# EasyEDA Pro project my_supercap_1.eprj, schematic 上板

## Sheets
1 控制板_辅助电源与保护: Board Name: 上板; Create Date: 2026-09-18; Page Name: 控制板_辅助电源与保护; Project Name: my_supercap_1; Schematic Name: 上板; Update Date: 2026-09-19; Company: 嘉立创EDA; Page Size: A4; Version: V1.0
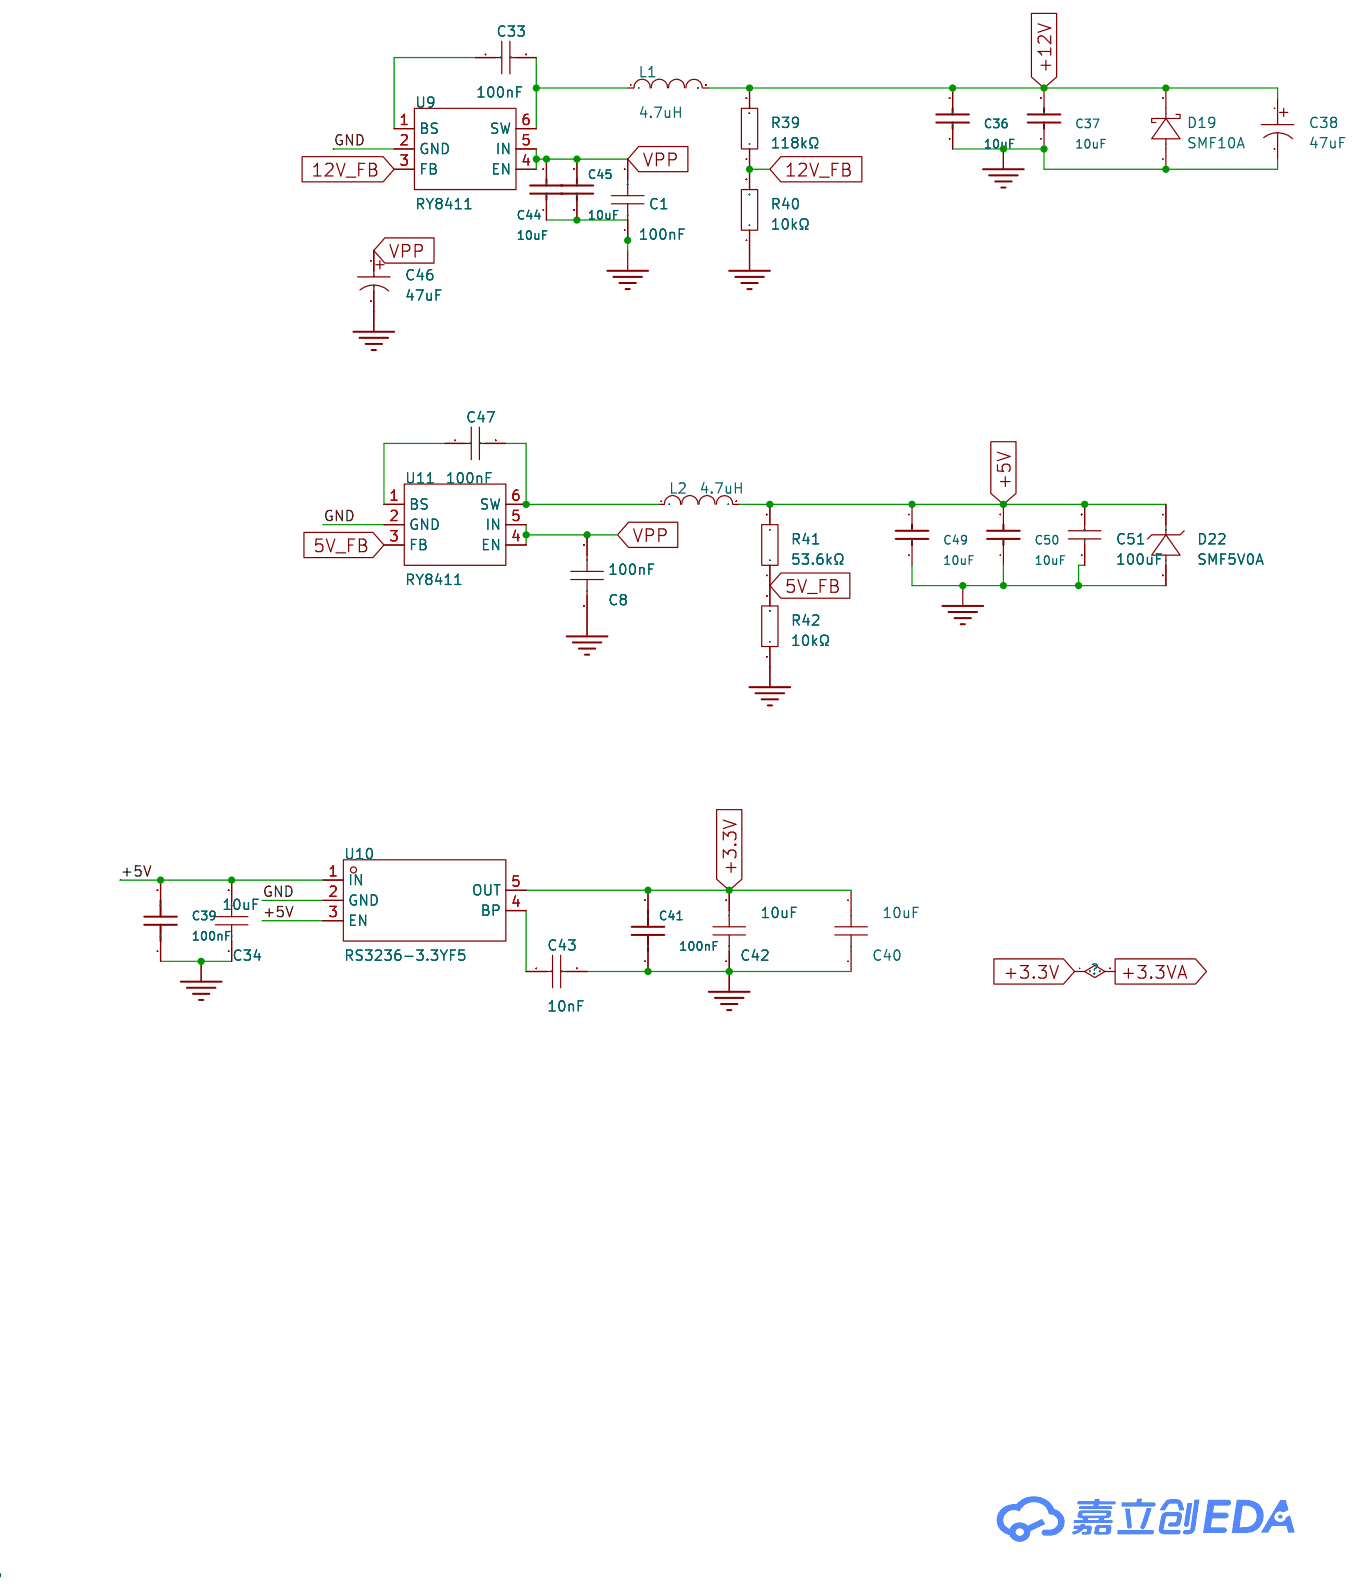
[diagram p4: 控制板_辅助电源与保护]
2 控制板_高侧隔离供电: Page Name: 控制板_高侧隔离供电
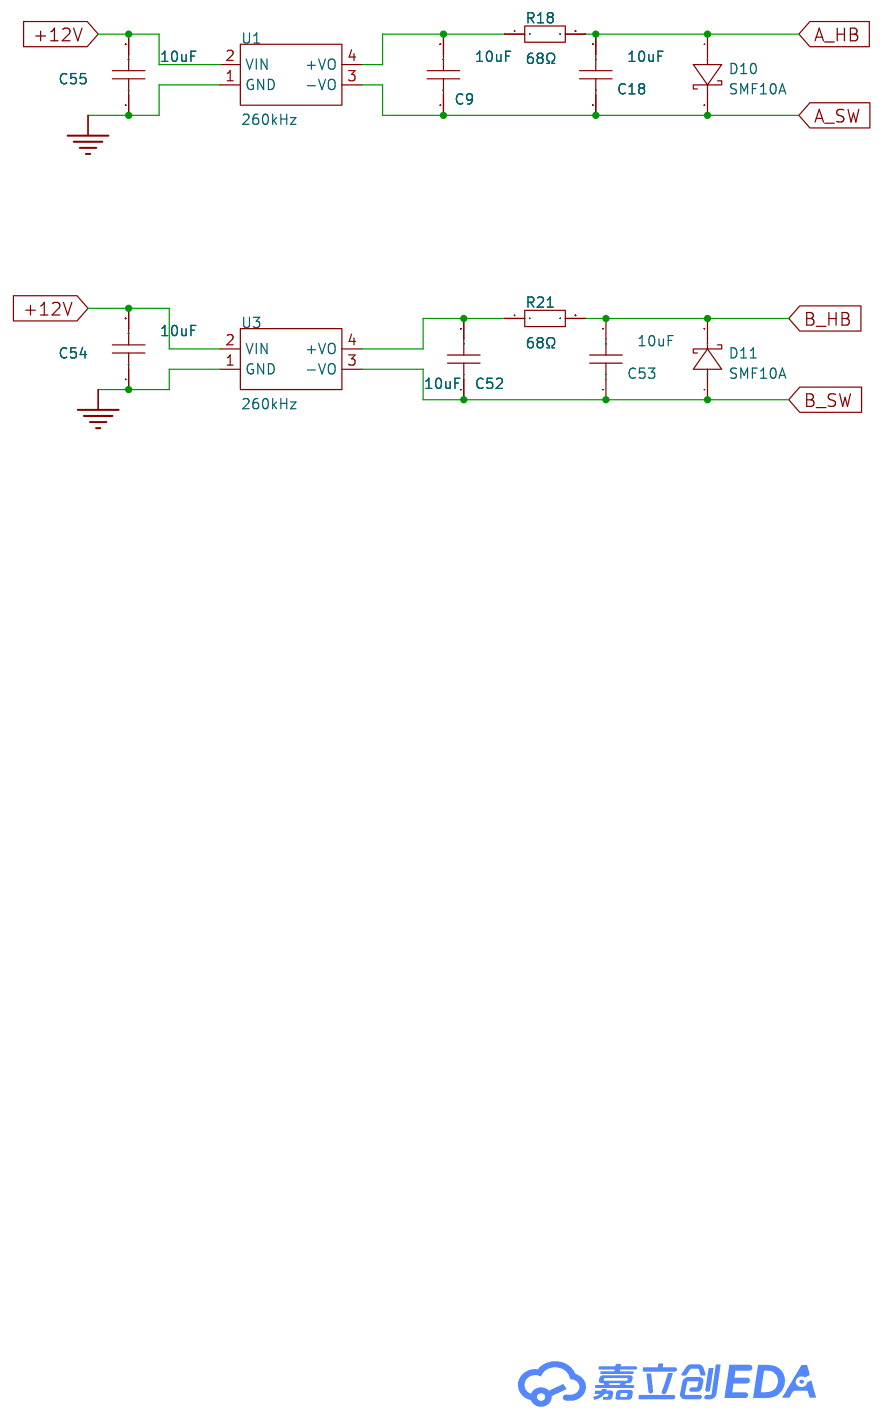
[diagram p5: 控制板_高侧隔离供电]
3 控制板_三路电流采样: Page Name: 控制板_三路电流采样; Update Date: 2026-09-20
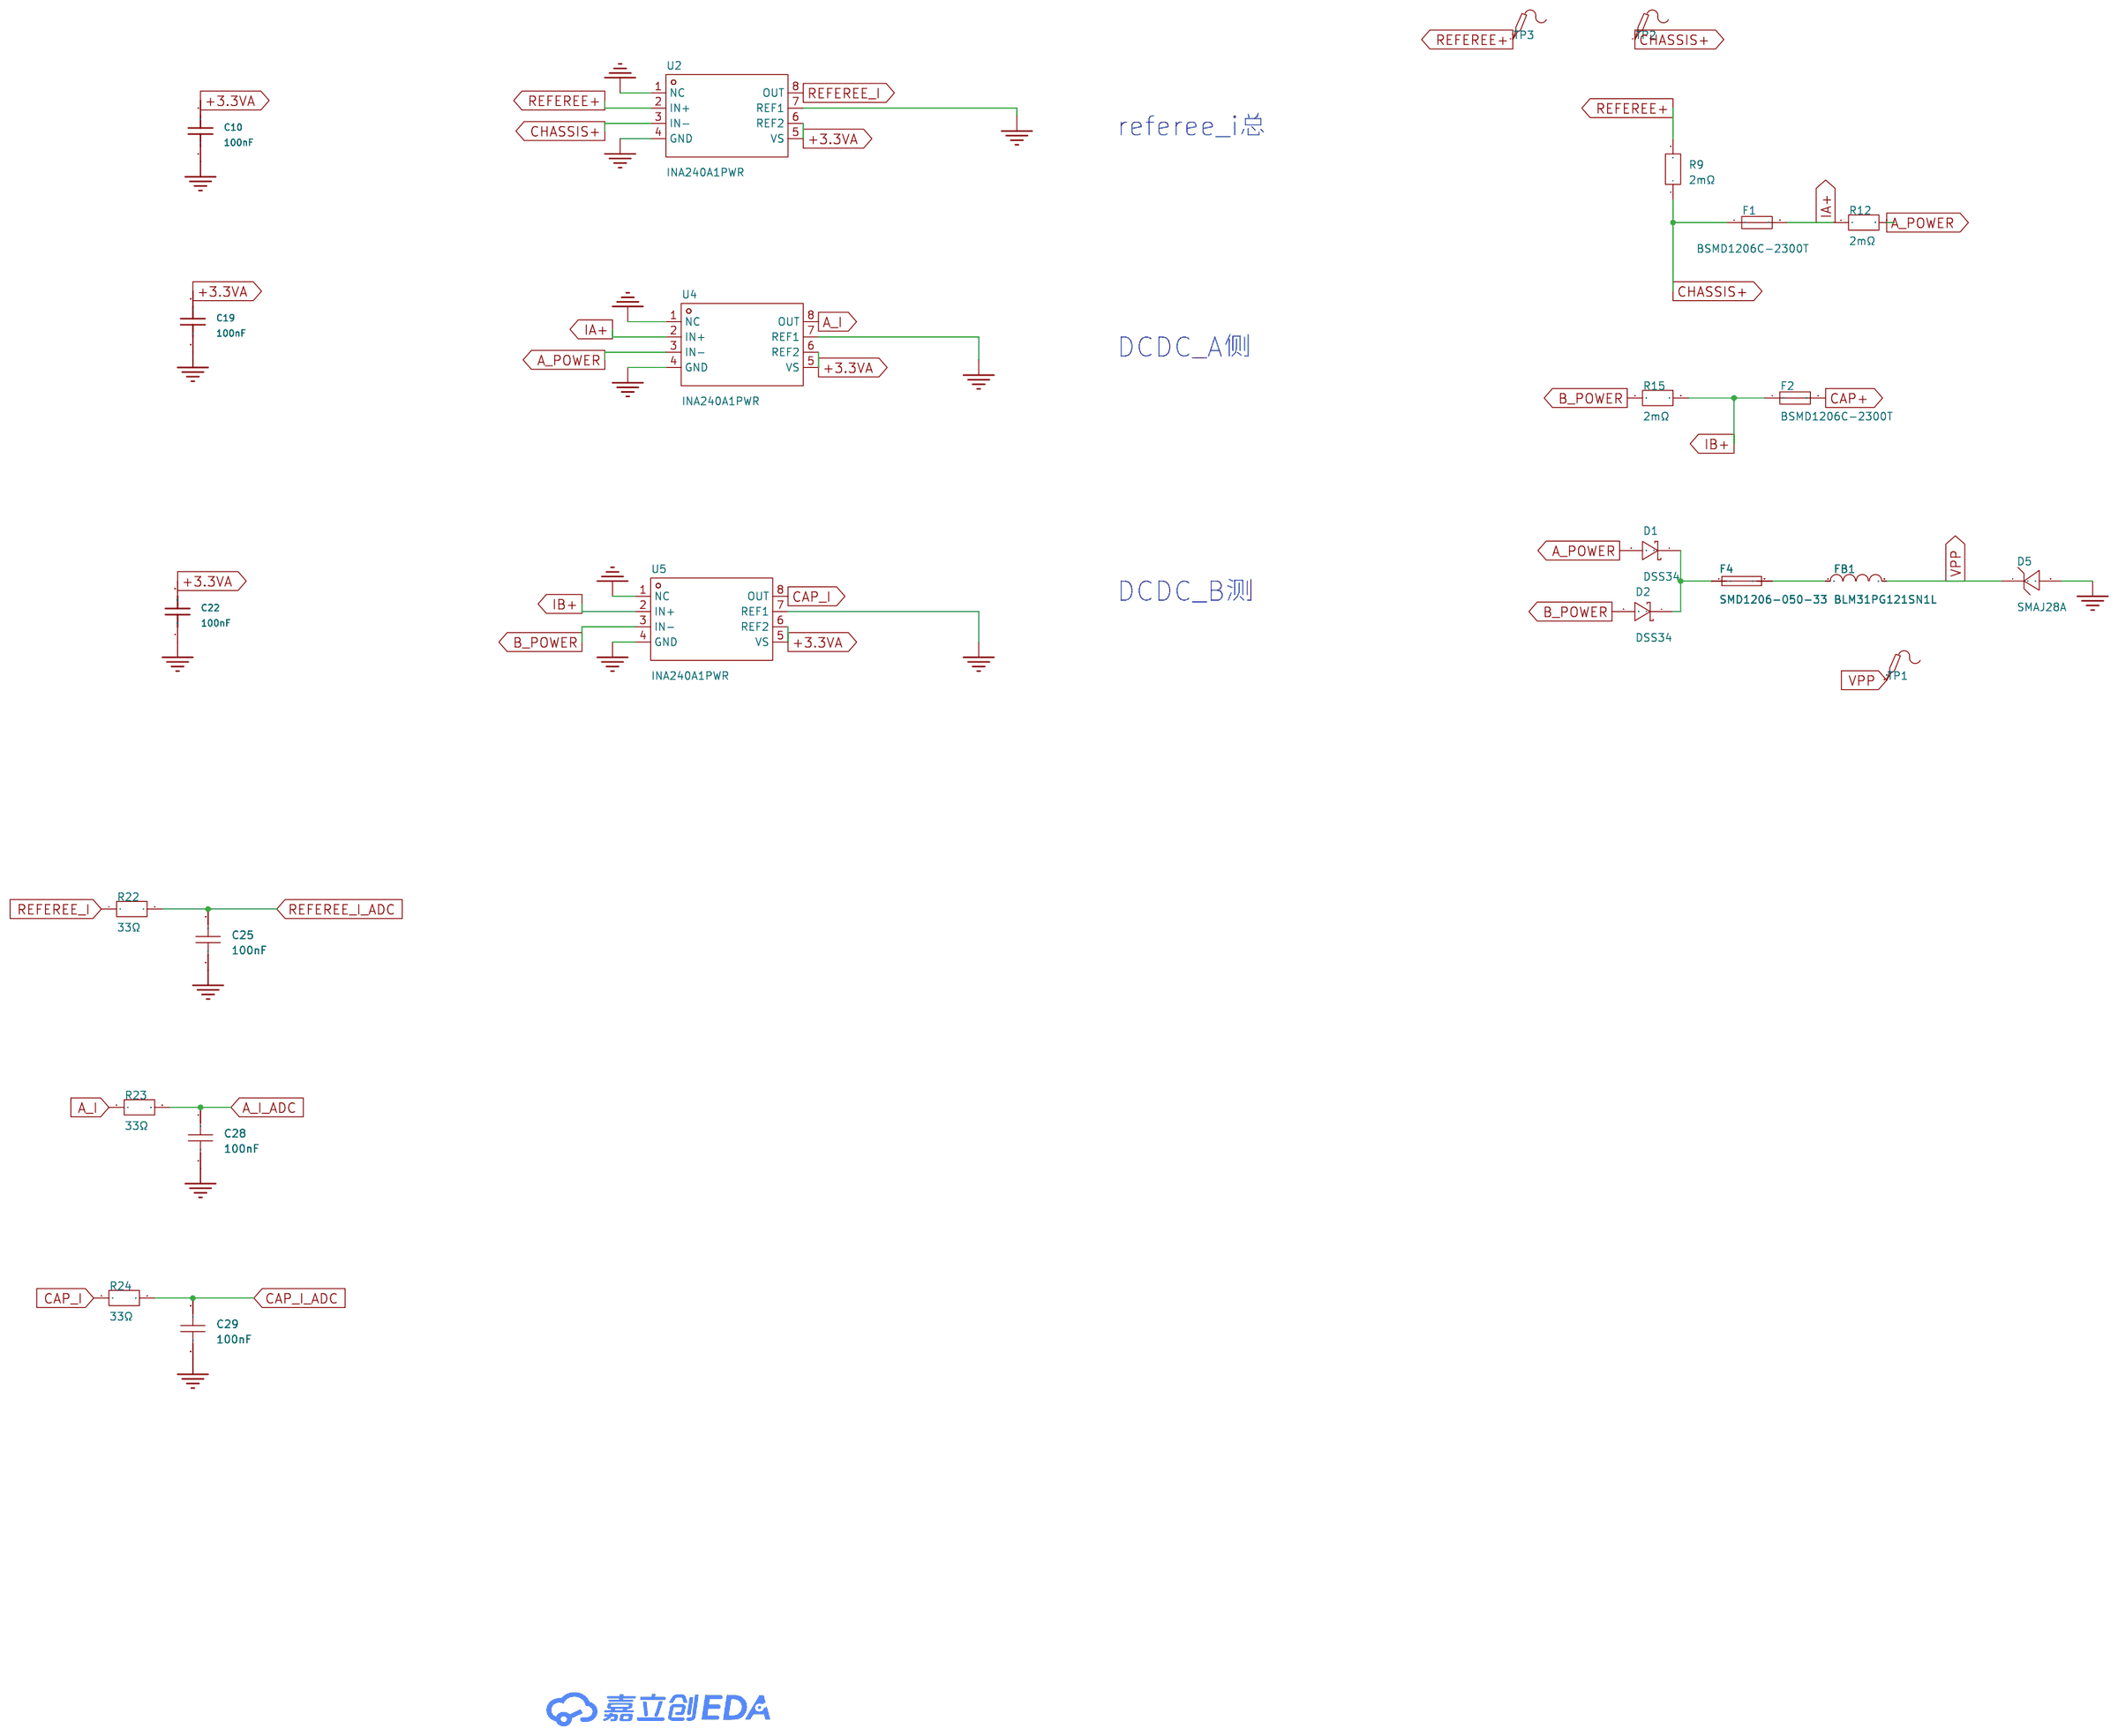
[diagram p6: 控制板_三路电流采样]
4 控制板_电压采样与模拟滤波: Page Name: 控制板_电压采样与模拟滤波
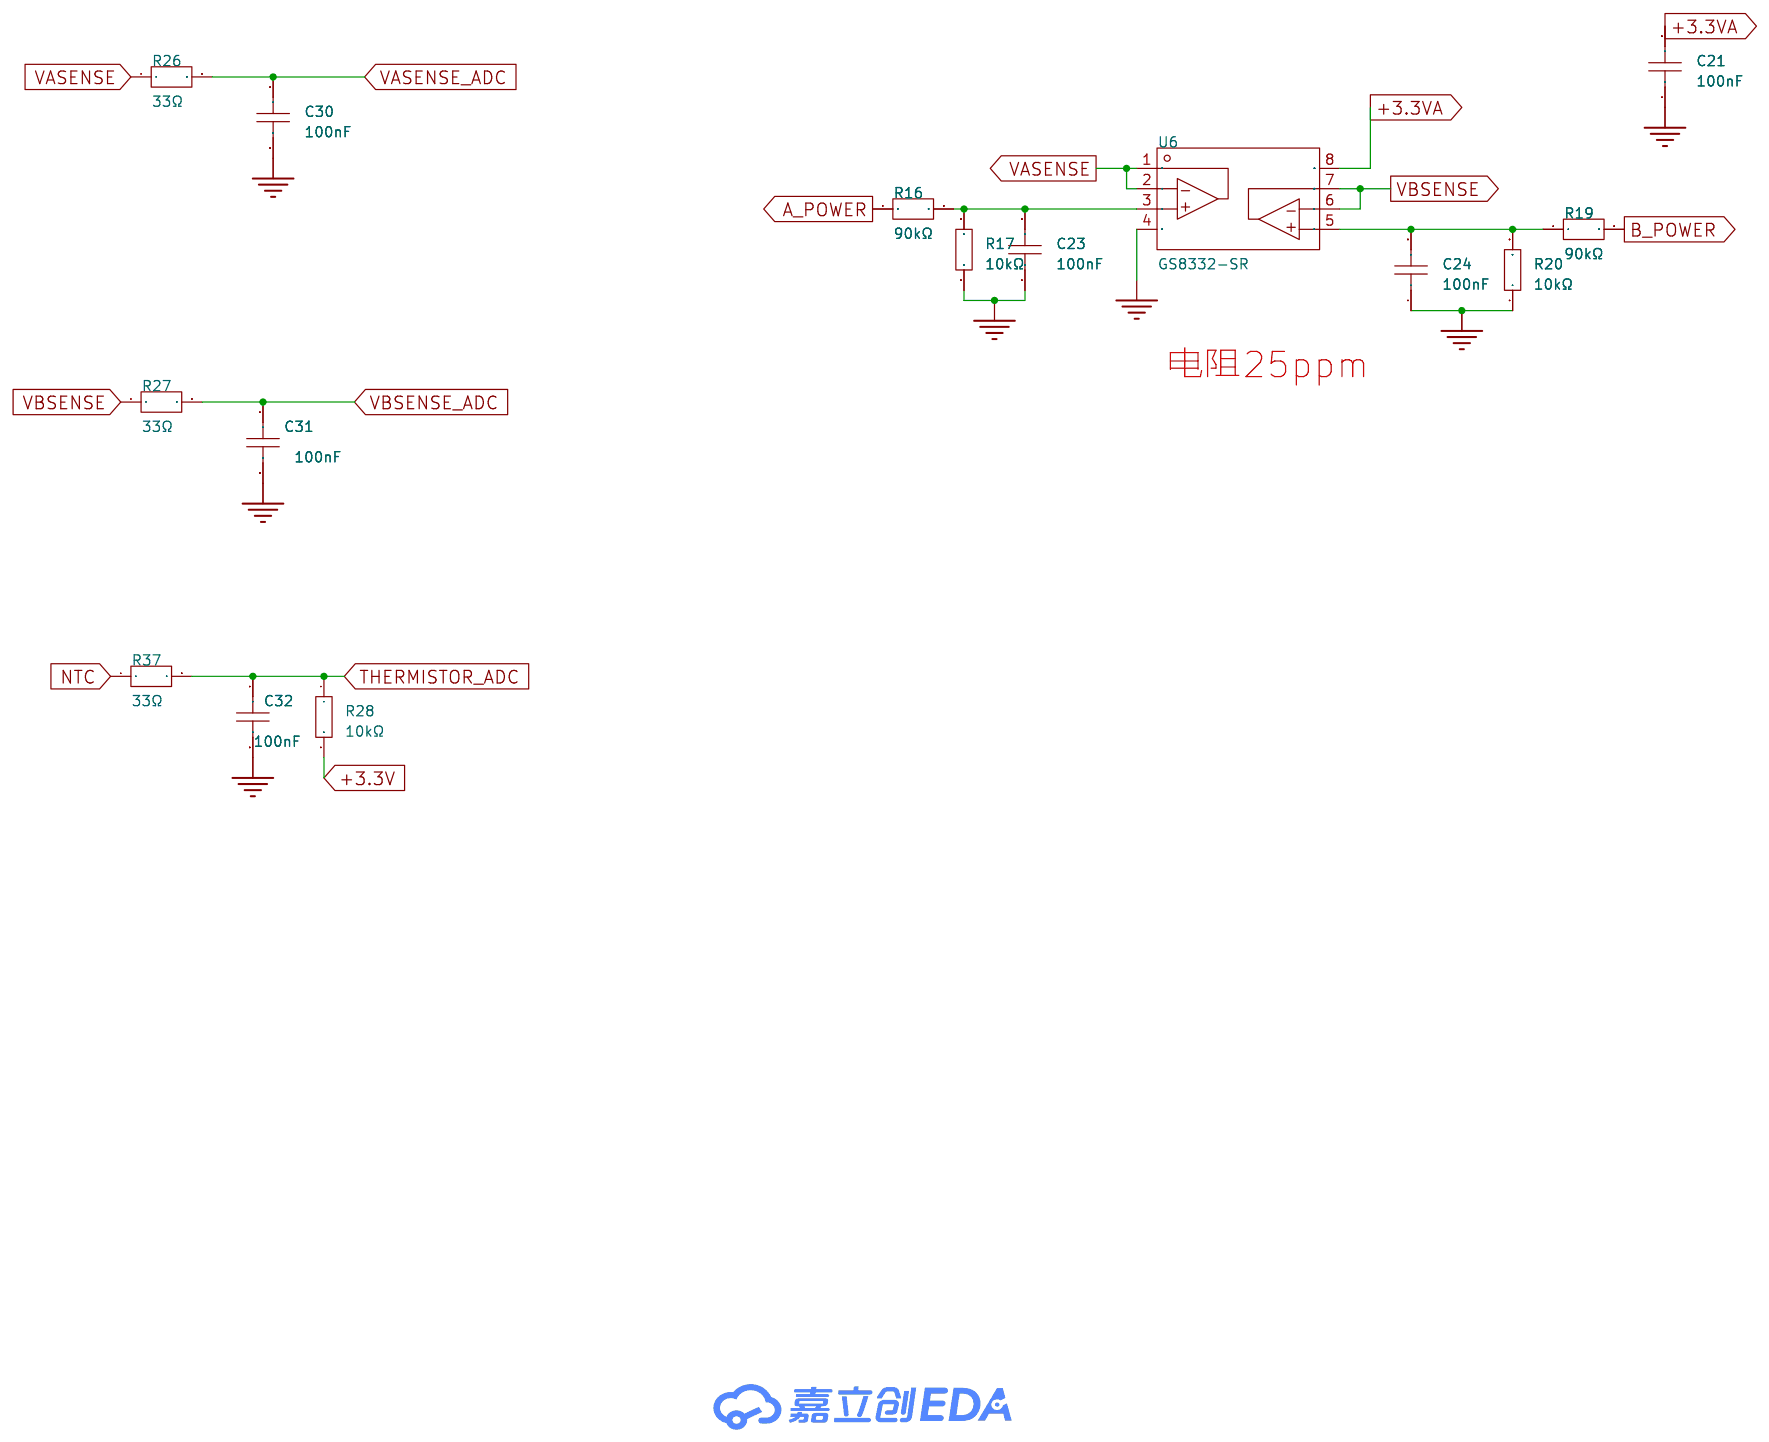
[diagram p7: 控制板_电压采样与模拟滤波]
5 控制板_STM32F334最小系统: Page Name: 控制板_STM32F334最小系统
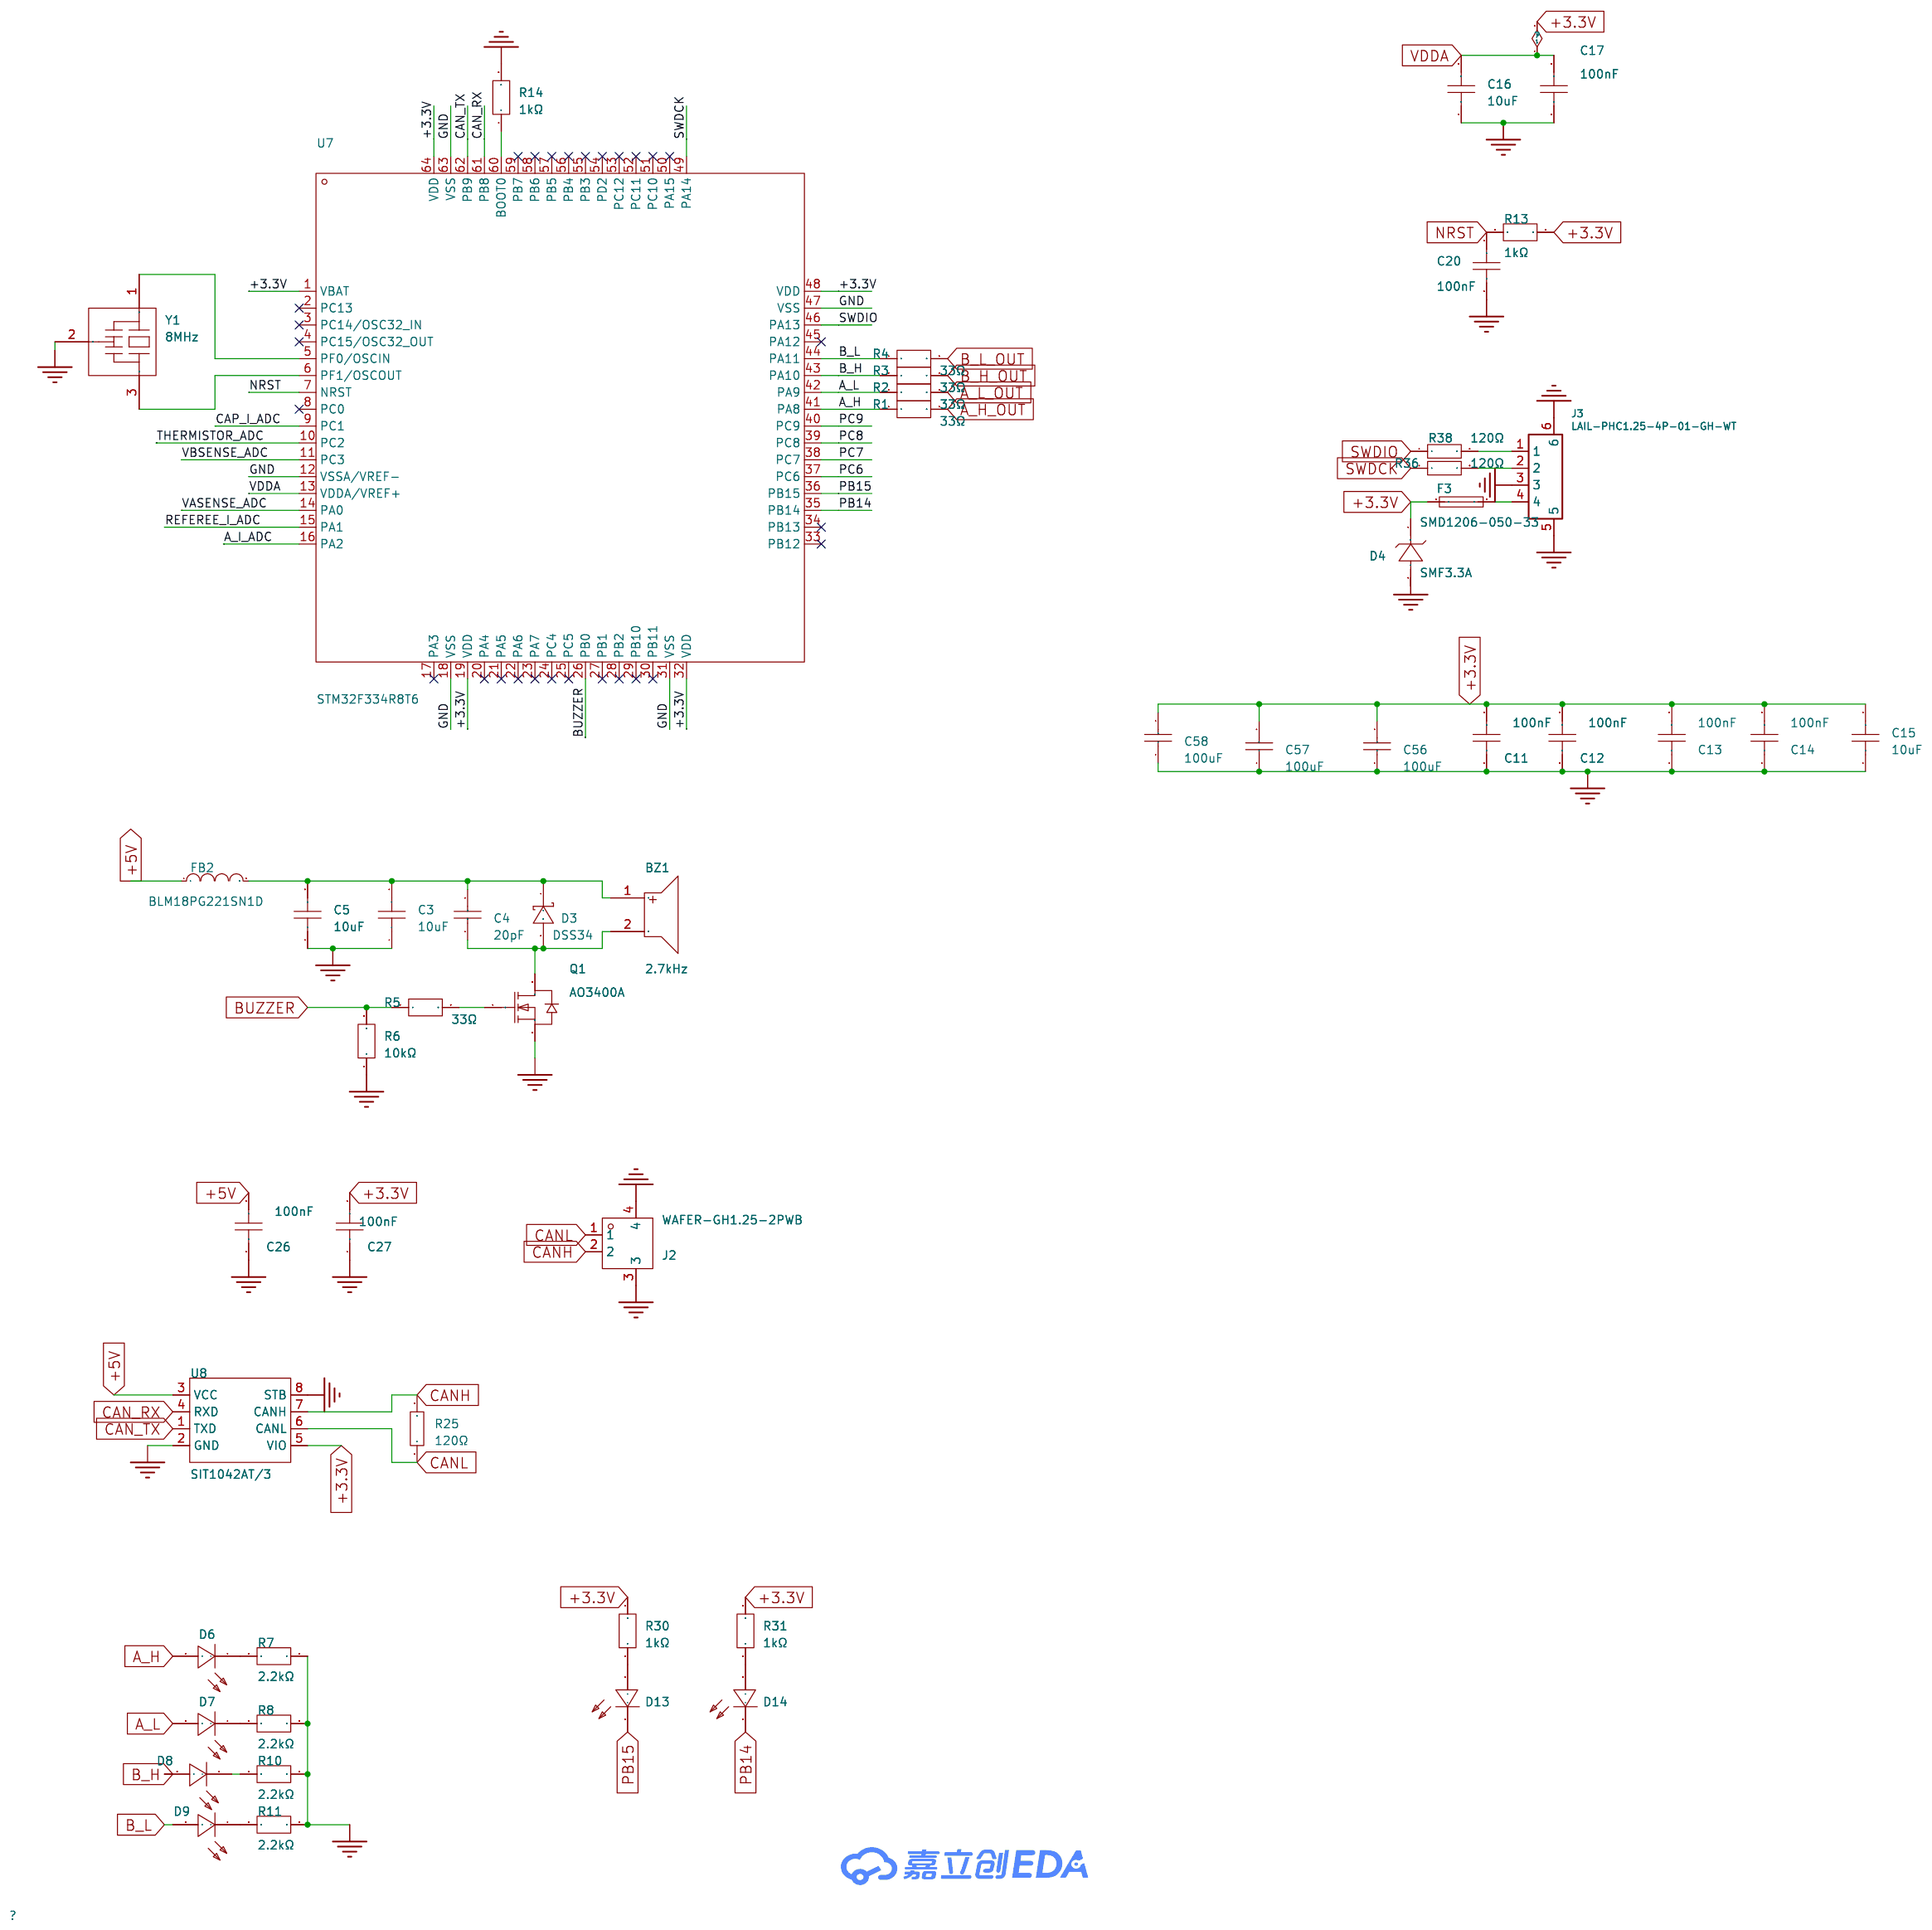
[diagram p8: 控制板_STM32F334最小系统]
6 上下板连接与调试测试点: Page Name: 上下板连接与调试测试点; Update Date: 2026-09-20
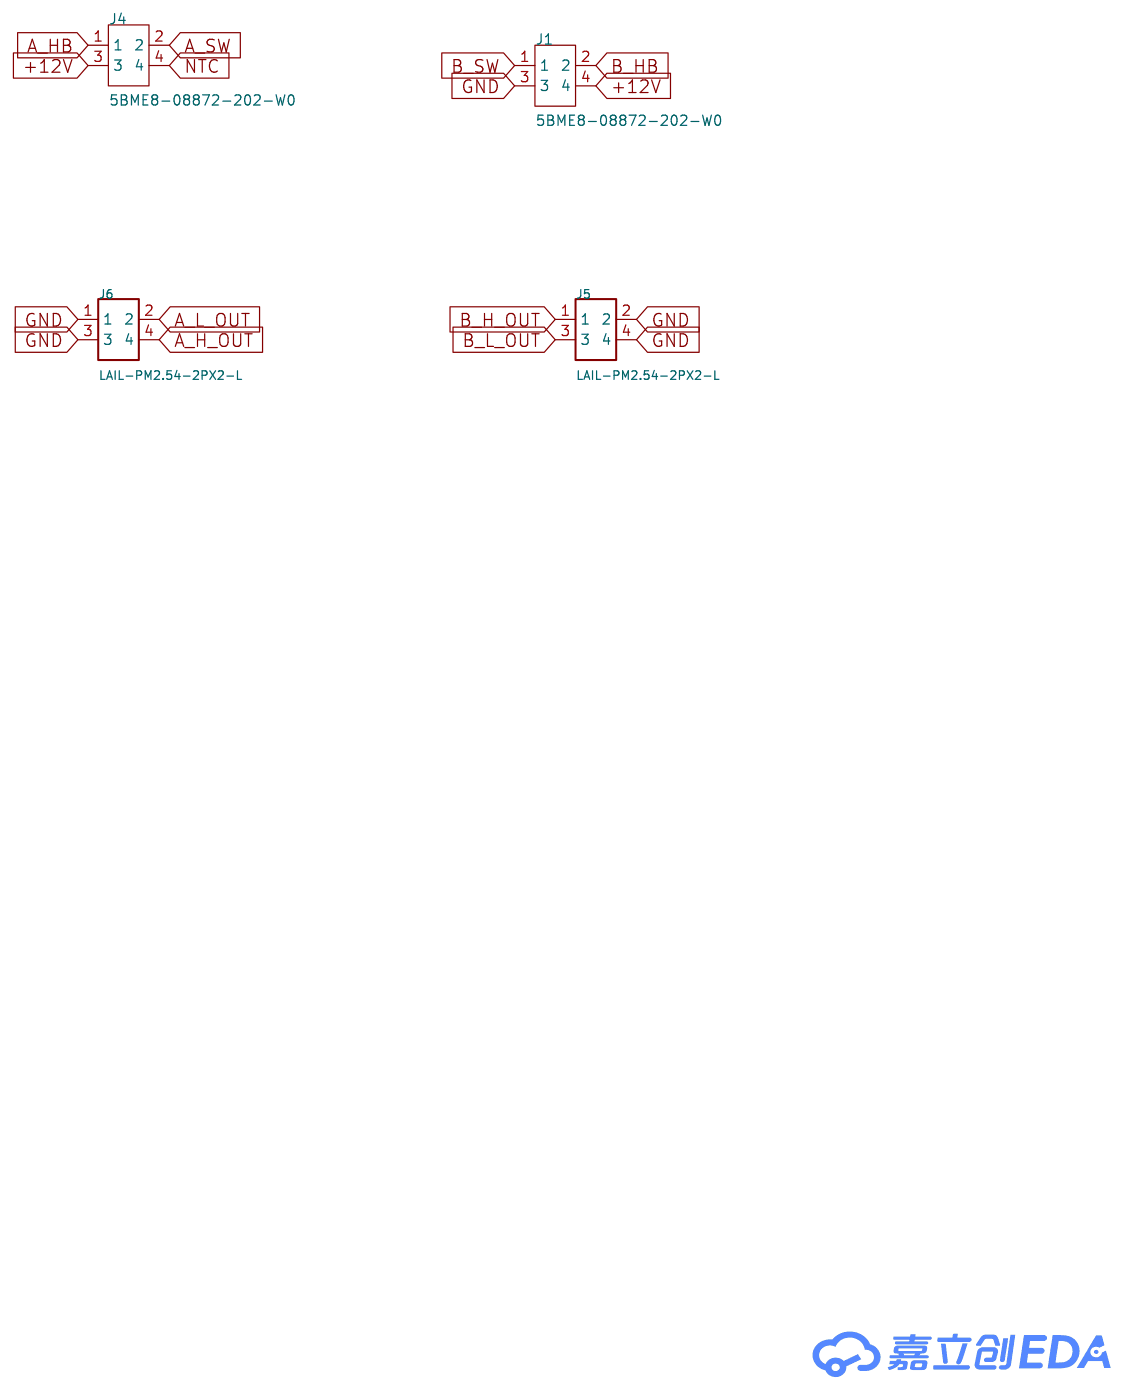
[diagram p9: 上下板连接与调试测试点]

## Parts
sheet 上下板连接与调试测试点
J1  5BME8-08872-202-W0  [CONN-SMD_5BME8-08872-202-W0]
J4  5BME8-08872-202-W0  [CONN-SMD_5BME8-08872-202-W0]
J5  LAIL-PM2.54-2PX2-L  [HDR-TH_4P-P2.54-V-F-R2-C2-S2.54-ESQ-102-33-L-D]
J6  LAIL-PM2.54-2PX2-L  [HDR-TH_4P-P2.54-V-F-R2-C2-S2.54-ESQ-102-33-L-D]
sheet 控制板_STM32F334最小系统
BZ1  2.7kHz  [BUZ-SMD_FUET-9032-XXV]
C3  10uF  [C0603]
C4  20pF  [C0603]
C5  10uF  [C0603]
C11  100nF  [C0603]
C12  100nF  [C0603]
C13  100nF  [C0603]
C14  100nF  [C0603]
C15  10uF  [C0603]
C16  10uF  [C0603]
C17  100nF  [C0603]
C20  100nF  [C0603]
C26  100nF  [C0603]
C27  100nF  [C0603]
C56  100uF  [C1206]
C57  100uF  [C1206]
C58  100uF  [C1206]
D3  DSS34  [SOD-123FL_L2.7-W1.8-LS3.8-RD]
D4  SMF3.3A  [SOD-123FL_L2.7-W1.8-LS3.7-RD]
D6  D-060306G1/SS2/G1  [LED0603-RD]
D7  D-060306G1/SS2/G1  [LED0603-RD]
D8  D-060306G1/SS2/G1  [LED0603-RD]
D9  D-060306G1/SS2/G1  [LED0603-RD]
D13  D-060306G1/SS2/G1  [LED0603-RD]
D14  D-060306G1/SS2/G1  [LED0603-RD]
F3  SMD1206-050-33  [F1206]
FB2  BLM18PG221SN1D  [L0603]
J2  WAFER-GH1.25-2PWB  [CONN-TH_2P-P1.25_XUNPU_WAFER-GH1.25-2PWB]
J3  LAIL-PHC1.25-4P-01-GH-WT  [CONN-SMD_4P-P1.25_HCTL_HC-GH-4PWTKK]
Q1  AO3400A  [SOT-23-3_L2.9-W1.3-P1.90-LS2.4-BR]
R1  33Ω  [R0603]
R2  33Ω  [R0603]
R3  33Ω  [R0603]
R4  33Ω  [R0603]
R5  33Ω  [R0603]
R6  10kΩ  [R0603]
R7  2.2kΩ  [R0603]
R8  2.2kΩ  [R0603]
R10  2.2kΩ  [R0603]
R11  2.2kΩ  [R0603]
R13  1kΩ  [R0603]
R14  1kΩ  [R0603]
R25  120Ω  [R0603]
R30  1kΩ  [R0603]
R31  1kΩ  [R0603]
R36  120Ω  [R0603]
R38  120Ω  [R0603]
U7  STM32F334R8T6  [LQFP-64_L10.0-W10.0-P0.50-LS12.0-BL]
U8  SIT1042AT/3  [SOIC-8_L4.9-W3.9-P1.27-LS6.0-BL]
Y1  8MHz  [OSC-SMD_3P-L3.2-W1.3-P1.2-L]
sheet 控制板_三路电流采样
C10  100nF  [C0603]
C19  100nF  [C0603]
C22  100nF  [C0603]
C25  100nF  [C0603]
C28  100nF  [C0603]
C29  100nF  [C0603]
D1  DSS34  [SOD-123FL_L2.7-W1.8-LS3.8-RD]
D2  DSS34  [SOD-123FL_L2.7-W1.8-LS3.8-RD]
D5  SMAJ28A  [SMA_L4.4-W2.8-LS5.4-RD]
F1  BSMD1206C-2300T  [F1206]
F2  BSMD1206C-2300T  [F1206]
F4  SMD1206-050-33  [F1206]
FB1  BLM31PG121SN1L  [L1206]
R9  2mΩ  [RES-SMD_L6.4-W3.2-1]
R12  2mΩ  [RES-SMD_L6.4-W3.2-1]
R15  2mΩ  [RES-SMD_L6.4-W3.2-1]
R22  33Ω  [R0603]
R23  33Ω  [R0603]
R24  33Ω  [R0603]
TP1  -  [Test-Point-0.5mm]
TP2  -  [Test-Point-0.5mm]
TP3  -  [Test-Point-0.5mm]
U2  INA240A1PWR  [TSSOP-8_L4.4-W3.0-P0.65-LS6.4-BL]
U4  INA240A1PWR  [TSSOP-8_L4.4-W3.0-P0.65-LS6.4-BL]
U5  INA240A1PWR  [TSSOP-8_L4.4-W3.0-P0.65-LS6.4-BL]
sheet 控制板_电压采样与模拟滤波
C21  100nF  [C0603]
C23  100nF  [C0603]
C24  100nF  [C0603]
C30  100nF  [C0603]
C31  100nF  [C0603]
C32  100nF  [C0603]
R16  90kΩ  [R0805]
R17  10kΩ  [R0603]
R19  90kΩ  [R0805]
R20  10kΩ  [R0603]
R26  33Ω  [R0603]
R27  33Ω  [R0603]
R28  10kΩ  [R0603]
R37  33Ω  [R0603]
U6  GS8332-SR  [SOP-8_L4.9-W3.9-P1.27-LS6.0-BL]
sheet 控制板_辅助电源与保护
C1  100nF  [C0603]
C8  100nF  [C0603]
C33  100nF  [C0603]
C34  10uF  [C0603]
C36  10uF  [C1206]
C37  10uF  [C1206]
C38  47uF  [CAP-SMD_BD6.3-L6.6-W6.6-LS7.6-FD]
C39  100nF  [C0603]
C40  10uF  [C0603]
C41  100nF  [C0603]
C42  10uF  [C0603]
C43  10nF  [C0603]
C44  10uF  [C1206]
C45  10uF  [C1206]
C46  47uF  [CAP-SMD_BD6.3-L6.6-W6.6-LS7.6-FD]
C47  100nF  [C0603]
C49  10uF  [C1206]
C50  10uF  [C1206]
C51  100uF  [C1206]
D19  SMF10A  [SOD-123FL_L3.0-W1.8-LS3.7-R-RD]
D22  SMF5V0A  [SOD-123_L2.7-W1.8-LS3.7-RD]
L1  4.7uH  [IND-SMD_L4.0-W4.0_SRN4018TA]
L2  4.7uH  [IND-SMD_L2.5-W2.0]
R39  118kΩ  [R0603]
R40  10kΩ  [R0603]
R41  53.6kΩ  [R0603]
R42  10kΩ  [R0603]
U9  RY8411  [SOT-23-6_L2.9-W1.6-P0.95-LS2.8-TL]
U10  RS3236-3.3YF5  [SOT-23-5_L3.0-W1.7-P0.95-LS2.8-BR]
U11  RY8411  [SOT-23-6_L2.9-W1.6-P0.95-LS2.8-TL]
sheet 控制板_高侧隔离供电
C9  10uF  [C1206]
C18  10uF  [C1206]
C52  10uF  [C1206]
C53  10uF  [C1206]
C54  10uF  [C1206]
C55  10uF  [C1206]
D10  SMF10A  [SOD-123FL_L3.0-W1.8-LS3.7-R-RD]
D11  SMF10A  [SOD-123FL_L3.0-W1.8-LS3.7-R-RD]
R18  68Ω  [R0603]
R21  68Ω  [R0603]
U1  260kHz  [PWRM-TH_4P-L11.5-W6.1-P2.54_1]
U3  260kHz  [PWRM-TH_4P-L11.5-W6.1-P2.54_1]

## Library data of the parts
J1 J4 = 5BME8-08872-202-W0: LCSC Part Name: 2x2P 间距:2.54mm 立贴; Supplier Part: C39832992; Manufacturer: SAMZO(三佐); Supplier Footprint: SMD,P=2.54mm; Datasheet: https://item.szlcsc.com/datasheet/5BME8-08872-202-W0/41562137.html; Supplier: LCSC; Holes Structure: 2x2P; Pitch: 2.54mm; Row Spacing: 2.54mm; Circular Hole / Square Hole: 方孔; Mounting Type: 立贴; Number of Rows: 双排; Number of Positions: 4P; Current Rating: 3A; Holes Direction: 顶部; Insulation Height: 8.5mm; Contact Material: 黄铜; Contact Plating: 金; Operating Temperature: -40℃~+105℃
J5 J6 = LAIL-PM2.54-2PX2-L: LCSC Part Name: 2x2P 间距:2.54mm 直插; Supplier Part: C54973841; Manufacturer: 莱联; Supplier Footprint: 插件,P=2.54mm; JLCPCB Part Class: 扩展库; Datasheet: https://item.szlcsc.com/datasheet/LAIL-PM2.54-2PX2-L/58554919.html; Supplier: LCSC; Holes Structure: 2x2P; Pitch: 2.54mm; Row Spacing: 2.54mm; Circular Hole / Square Hole: 方孔; Mounting Type: 直插; Number of Rows: 双排; Number of Positions: 4P; Current Rating: 3A; Voltage Rating (Max): 250V; Holes Direction: 顶部; Insulation Height: 8.5mm; Contact Material: 黄铜; Contact Plating: 金; Operating Temperature: -25℃~+80℃; PIN Length: 3mm
BZ1 = FUET-9032-05: LCSC Part Name: 蜂鸣器; Supplier Part: C2690510; Manufacturer: FUET(福声科技); Supplier Footprint: SMD,D=9mm; JLCPCB Part Class: 扩展库; Datasheet: https://item.szlcsc.com/datasheet/FUET-9032-05/2799828.html; Supplier: LCSC; Technology: 电磁式; Voltage - Supply: 4V~7V; Current Consumption: 100mA; Sound Pressure Level(SPL): 85dB; Diameter(φD): 9mm; Length: 10.5mm; Width: 9mm; Height: 3.2mm; Operating Temperature: -30℃~+70℃; Mounting Type: 贴片
C3 C5 C15 C16 = CGA0603X5R106K100JT: LCSC Part Name: 10uF ±10% 10V; Supplier Part: C6119842; Manufacturer: HRE(芯声); Supplier Footprint: 0603; JLCPCB Part Class: 扩展库; Datasheet: https://item.szlcsc.com/datasheet/CGA0603X5R106K100JT/7062548.html; Supplier: LCSC; Tolerance: ±10%; Voltage Rating: 10V; Temperature Coefficient: X5R
C4 = CC0603JRNPO9BN200: LCSC Part Name: 20pF ±5% 50V; Supplier Part: C105621; Manufacturer: YAGEO(国巨); Supplier Footprint: 0603; JLCPCB Part Class: 扩展库; Datasheet: https://atta.szlcsc.com/upload/public/pdf/source/20170505/1493957838062.pdf; Supplier: LCSC; Tolerance: ±5%; Voltage Rated: 50V; Temperature Coefficient: NP0
C1 C8 C11-C14 C17 C20 C21 C23-C32 = 0603B104M500NT: LCSC Part Name: 100nF ±20% 50V; Supplier Part: C286510; Manufacturer: FH(风华); Supplier Footprint: 0603; JLCPCB Part Class: 扩展库; Datasheet: https://item.szlcsc.com/datasheet/0603B104M500NT/271775.html; Supplier: LCSC; Tolerance: ±20%; Voltage Rating: 50V; Temperature Coefficient: X7R
C51 C56-C58 = CL31A107MQHNNNE: LCSC Part Name: 100uF ±20% 6.3V; Supplier Part: C15008; Manufacturer: SAMSUNG(三星); Supplier Footprint: 1206; JLCPCB Part Class: 基础库; Datasheet: https://item.szlcsc.com/datasheet/CL31A107MQHNNNE/15681.html; Supplier: LCSC; Tolerance: ±20%; Voltage Rating: 6.3V; Temperature Coefficient: X5R
D1-D3 = DSS34_C511866: LCSC Part Name: 电压:40V 电流:3A; Supplier Part: C511866; Manufacturer: BORN(伯恩半导体); Supplier Footprint: SOD-123FL; JLCPCB Part Class: 扩展库; Datasheet: https://item.szlcsc.com/datasheet/DSS34/526331.html; Supplier: LCSC; Voltage - Forward(Vf@If): 550mV@3A; Voltage - DC Reverse(Vr): 40V; Current - Rectified: 3A; Reverse Leakage Current (Ir): 500uA@40V; Operating Junction Temperature Range: -50℃~+125℃
D4 = SMF3.3A_C51891832: LCSC Part Name: 单向 3.3V 22.7A@10/1000us; Supplier Part: C51891832; Manufacturer: R+O(宏嘉诚); Supplier Footprint: SOD-123FL; JLCPCB Part Class: 扩展库; Datasheet: https://item.szlcsc.com/datasheet/SMF3.3A/54568752.html; Supplier: LCSC; Polarity: 单向; Reverse Stand-Off Voltage (Vrwm): 3.3V; Clamping Voltage: 8.8V; Peak Pulse Current (Ipp): 22.7A@10/1000us; Peak Pulse Power Dissipation (Ppp): 200W@10/1000us; Voltage - Breakdown: 6.5V; Reverse Leakage Current (Ir): 500uA; Number of Channels: 单路; Operating Temperature: -55℃~+150℃; level of protection: IEC 61000-4-2; Type: TVS
D6-D9 D13 D14 = D-060306G1/SS2/G1: LCSC Part Name: 翠绿; Supplier Part: C118334; Manufacturer: ARKLED(方舟); Supplier Footprint: 0603; Datasheet: https://item.szlcsc.com/datasheet/D-060306G1%252FSS2%252FG1/119599.html; Supplier: LCSC; Illumination Color: 翠绿色; Voltage - Forward(Vf): 2.8V; Power(Watts): 70mW; Forward Current: 5mA; Wavelength - Dominant: 526nm~532nm; Diode Configuration: 独立二极管; Lens Color: 无色透明透镜; Luminous Intensity: 500mcd; Viewing Angle: 120°; Mounting Style: 正贴; Operating Temperature: -30℃~+80℃
F3 F4 = SMD1206-050-33: LCSC Part Name: 33V 500mA; Supplier Part: C46641017; Manufacturer: R+O(宏嘉诚); Supplier Footprint: 1206; JLCPCB Part Class: 扩展库; Datasheet: https://item.szlcsc.com/datasheet/SMD1206-050-33/48798723.html; Supplier: LCSC; Voltage - Max: 33V; Current - Max: 40A; Hold Current: 500mA; Trip Current: 1A; Power Dissipation: 600mW; Resistance - Initial (Ri) (Min): 150mΩ; Resistance - Post Trip (R1) (Max): 750mΩ; Time to Trip(Max): 100ms; Length: 3.6mm; Width: 1.9mm
FB2 = BLM18PG221SN1D: LCSC Part Name: 单路 0603磁珠 阻抗220Ω@100MHz; Supplier Part: C80165; Manufacturer: muRata(村田); Supplier Footprint: 0603; Datasheet: https://item.szlcsc.com/datasheet/BLM18PG221SN1D/81310.html; Supplier: LCSC; Impedance @ Frequency: 220Ω@100MHz; Tolerance: ±25%; DC Resistance(DCR): 100mΩ; Current Rating: 1.4A; Number of Circuits: 1; Operating Temperature: -55℃~+125℃
J2 = WAFER-GH1.25-2PWB: LCSC Part Name: 1x2P 间距:1.25mm 卧贴 系列:GH; Supplier Part: C3029377; Manufacturer: XUNPU(讯普); Supplier Footprint: SMD,P=1.25mm,卧贴; JLCPCB Part Class: 扩展库; Datasheet: https://item.szlcsc.com/datasheet/WAFER-GH1.25-2PWB/3561389.html; Supplier: LCSC; Pins Structure: 1x2P; Pitch: 1.25mm; Mounting Type: 卧贴; Reference Series: GH; Number of Pins: 2P; Number of Rows: 1; Number of PINs Per Row: 2; Current Rating: 1A; Contact Material: 黄铜; Contact Plating: 锡; Operating Temperature: -25℃~+85℃; Voltage Rating: 125V; Plastic Material: LCP; Supplementary Features: 辅助焊脚; Color: 米色; Z-Height of the Board: 4.35mm; X-Length of Bottom Edge on Board (Spacing Line): 5.75mm; Y-Width of Bottom Edge on Board: 5mm
J3 = LAIL-PHC1.25-4P-01-GH-WT: LCSC Part Name: 1x4P 间距:1.25mm 卧贴 系列:GH; Supplier Part: C54905900; Manufacturer: LAILAN(莱联); Supplier Footprint: SMD,P=1.25mm,卧贴; JLCPCB Part Class: 扩展库; Datasheet: https://item.szlcsc.com/datasheet/LAIL-PHC1.25-4P-01-GH-WT/58431077.html; Supplier: LCSC; Pins Structure: 1x4P; Pitch: 1.25mm; Mounting Type: 卧贴; Reference Series: GH; Number of Pins: 4P; Number of Rows: 1; Number of PINs Per Row: 4; Current Rating: 1A; Contact Material: 磷青铜; Contact Plating: 锡; Operating Temperature: -25℃~+85℃; Voltage Rating: 50V; Plastic Material: LCP; Flame Retardant Rating: UL94V-0; Supplementary Features: 辅助焊脚; Color: 米黄色; Z-Height of the Board: 4.4mm; X-Length of Bottom Edge on Board (Spacing Line): 8.25mm; Y-Width of Bottom Edge on Board: 4.9mm
Q1 = AO3400A_C20917: LCSC Part Name: N沟道 耐压:30V; Supplier Part: C20917; Manufacturer: AOS; Supplier Footprint: SOT-23; JLCPCB Part Class: 基础库; Datasheet: https://item.szlcsc.com/datasheet/AO3400A/21629.html; Supplier: LCSC; Number: 1个N沟道; Drain to Source Voltage: 30V; Current - Continuous Drain(Id): 5.7A; RDS(on): 48mΩ@2.5V; Pd - Power Dissipation: 1.4W; Gate Threshold Voltage (Vgs(th)): 1.45V; Gate Charge(Qg): 7nC@10V; Input Capacitance(Ciss): 630pF; Reverse Transfer Capacitance (Crss@Vds): 50pF; Operating Temperature: -55℃~+150℃; Type: N沟道; Output Capacitance(Coss): 75pF; Vgs: ±12V
R1-R5 R22-R24 R26 R27 R37 = FRC0603F33R0TS: LCSC Part Name: 33Ω ±1% 100mW 厚膜电阻; Supplier Part: C2909394; Manufacturer: FOJAN(富捷); Supplier Footprint: 0603; JLCPCB Part Class: 扩展库; Datasheet: https://item.szlcsc.com/datasheet/FRC0603F33R0TS/3186329.html; Supplier: LCSC; Type: 厚膜电阻; Tolerance: ±1%; Power(Watts): 100mW; Voltage-Supply(Max): 75V; Temperature Coefficient: ±100ppm/℃; Operating Temperature: -55℃~+155℃
R6 = FRC0603F1002TS: LCSC Part Name: 10kΩ ±1% 100mW 厚膜电阻; Supplier Part: C2906982; Manufacturer: FOJAN(富捷); Supplier Footprint: 0603; JLCPCB Part Class: 扩展库; Datasheet: https://item.szlcsc.com/datasheet/FRC0603F1002TS/3180495.html; Supplier: LCSC; Type: 厚膜电阻; Tolerance: ±1%; Power(Watts): 100mW; Voltage-Supply(Max): 75V; Temperature Coefficient: ±100ppm/℃; Operating Temperature: -55℃~+155℃
R7 R8 R10 R11 = FRC0603F2201TS: LCSC Part Name: 2.2kΩ ±1% 100mW 厚膜电阻; Supplier Part: C2907005; Manufacturer: FOJAN(富捷); Supplier Footprint: 0603; JLCPCB Part Class: 扩展库; Supplier: LCSC; Type: 厚膜电阻; Tolerance: ±1%; Power(Watts): 100mW; Voltage-Supply(Max): 75V; Temperature Coefficient: ±100ppm/℃; Operating Temperature: -55℃~+155℃
R13 R14 R30 R31 = FRC0603F1001TS: LCSC Part Name: 1kΩ ±1% 100mW 厚膜电阻; Supplier Part: C2907002; Manufacturer: FOJAN(富捷); Supplier Footprint: 0603; Datasheet: https://item.szlcsc.com/datasheet/FRC0603F1001TS/3180515.html; Supplier: LCSC; Type: 厚膜电阻; Tolerance: ±1%; Power(Watts): 100mW; Voltage-Supply(Max): 75V; Temperature Coefficient: ±100ppm/℃; Operating Temperature: -55℃~+155℃
R25 R36 R38 = 0603WAF1200T5E: LCSC Part Name: 120Ω ±1% 100mW 厚膜电阻; Supplier Part: C22787; Manufacturer: UNI-ROYAL(厚声); Supplier Footprint: 0603; JLCPCB Part Class: 基础库; Datasheet: https://item.szlcsc.com/datasheet/0603WAF1200T5E/23514.html; Supplier: LCSC; Type: 厚膜电阻; Tolerance: ±1%; Power(Watts): 100mW; Voltage-Supply(Max): 75V; Temperature Coefficient: ±100ppm/℃; Operating Temperature: -55℃~+155℃
U7 = STM32F334R8T6: LCSC Part Name: 带DSP和FPU的主流混合信号ARM Cortex-M4 MCU，具有64 KB Flash、72 MHz CPU、CCM、5 Msps 12位ADC、比较器、运算放大器和高分辨率定时器; Supplier Part: C80577; Manufacturer: ST(意法半导体); Supplier Footprint: LQFP-64(10x10); JLCPCB Part Class: 扩展库; Datasheet: https://item.szlcsc.com/datasheet/STM32F334R8T6/81727.html; Supplier: LCSC; CPU Core: ARM Cortex-M4; CPU Maximum Speed: 72MHz; Core Size: 32 Bit; Program Storage Size: 64KB; Program Memory Type: FLASH; RAM Size: 12KB; Number of I/O: 51; ADC (Bit): 12bit; DAC (Bit): 12bit; Oscillator Type: 内置; Voltage - Supply: 2V~3.6V; Operating Temperature: -40℃~+85℃
U8 = SIT1042AT/3: LCSC Part Name: SIT1042A CAN FD待机模式总线收发器; Supplier Part: C5382545; Manufacturer: SIT(芯力特); Supplier Footprint: SOP-8; JLCPCB Part Class: 扩展库; Datasheet: https://item.szlcsc.com/datasheet/SIT1042AT%252F3/6255019.html; Supplier: LCSC; Type: CAN-FD收发器; Data Rate: 5Mbps; Voltage - Supply: 4.5V~5.5V; Current - Supply: 70mA; Operating Temperature: -40℃~+150℃; Number of Channels: 1; Quiescent Supply Current: 5uA; Features: 短路保护；唤醒功能；热关断保护；欠压保护；ESD保护；TXD占优超时；低功耗模式
Y1 = CSTCE8M00G55-R0: LCSC Part Name: 停产 8M ±0.5% 33pF; Supplier Part: C70457; Manufacturer: muRata(村田); Supplier Footprint: SMD3213-3P; JLCPCB Part Class: 扩展库; Datasheet: https://item.szlcsc.com/datasheet/CSTCE8M00G55-R0/71553.html; Supplier: LCSC; Built - in Load Capacitance: 33pF; Operating Temperature: -20℃~+80℃
C10 C19 C22 C39 C41 = CC0603KRX7R9BB104: LCSC Part Name: 100nF ±10% 50V; Supplier Part: C14663; Manufacturer: YAGEO(国巨); Supplier Footprint: 0603; JLCPCB Part Class: 基础库; Datasheet: https://item.szlcsc.com/datasheet/CC0603KRX7R9BB104/15331.html; Supplier: LCSC; Tolerance: ±10%; Voltage Rating: 50V; Temperature Coefficient: X7R
D5 = SMAJ28A_C148227: LCSC Part Name: 单向TVS 28V截止 峰值浪涌电流：8.8A@10/1000us; Supplier Part: C148227; Manufacturer: Littelfuse(美国力特); Supplier Footprint: DO-214AC(SMA); JLCPCB Part Class: 扩展库; Datasheet: https://item.szlcsc.com/datasheet/SMAJ28A/159560.html; Supplier: LCSC; Polarity: 单向; Reverse Stand-Off Voltage (Vrwm): 28V; Clamping Voltage: 45.4V; Peak Pulse Current (Ipp): 8.8A@10/1000us; Peak Pulse Power Dissipation (Ppp): 400W@10/1000us; Voltage - Breakdown: 34.4V; Reverse Leakage Current (Ir): 1uA; Number of Channels: 单路; Operating Temperature: -65℃~+150℃; level of protection: IEC 61000-4-4；IEC 61000-4-2; Type: TVS
F1 F2 = BSMD1206C-2300T: LCSC Part Name: 1206 30A 32V 一次性 慢速熔断; Supplier Part: C41398514; Manufacturer: BHFUSE(佰宏); Supplier Footprint: 1206; JLCPCB Part Class: 扩展库; Datasheet: https://item.szlcsc.com/datasheet/BSMD1206C-2300T/43191784.html; Supplier: LCSC; Type: 贴片式保险丝; Current Rating: 30A; Voltage Rating (AC): 32V; Voltage Rating (DC): 32V; Operating Temperature: -55℃~+150℃; Melting I2t: 109; Interrupt Rating: 150A; Length: 3.2mm; Width: 1.6mm
FB1 = BLM31PG121SN1L: LCSC Part Name: 单路 1206磁珠 阻抗120Ω@100MHz; Supplier Part: C85841; Manufacturer: muRata(村田); Supplier Footprint: 1206; JLCPCB Part Class: 扩展库; Datasheet: https://item.szlcsc.com/datasheet/BLM31PG121SN1L/87017.html; Supplier: LCSC; Impedance @ Frequency: 120Ω@100MHz; Tolerance: ±25%; DC Resistance(DCR): 20mΩ; Current Rating: 3.5A; Number of Circuits: 1; Operating Temperature: -55℃~+125℃
R9 R12 R15 = HoLLR2512-3W-2mR-1%: LCSC Part Name: 2mΩ ±1% 3W; Supplier Part: C2994640; Manufacturer: Milliohm(毫欧); Supplier Footprint: 2512; JLCPCB Part Class: 扩展库; Datasheet: https://atta.szlcsc.com/upload/public/pdf/source/20220330/9E8D3880B1628B3B70C68092C8A7E08B.pdf; Supplier: LCSC; Type: 采样电阻; Tolerance: ±1%; Power(Watts): 3W; Rated Current: 77.5A; Temperature Coefficient: ±50ppm/℃; Mounting Sytle: 贴片
TP1-TP3 = Test-Point
U2 U4 U5 = INA240A1PWR: LCSC Part Name: 具有增强型PWM抑制功能的高侧和低侧双向零漂移电流感测放大器; Supplier Part: C93965; Manufacturer: TI(德州仪器); Supplier Footprint: TSSOP-8; JLCPCB Part Class: 扩展库; Datasheet: https://www.ti.com/cn/lit/ds/symlink/ina240.pdf; Supplier: LCSC; Number of Channels: 1; Vcm - Common Mode Voltage: -4V~80V; Gain: 20V/V; Bandwidth: 400kHz; Ib - Input Bias Current: 90uA; Vos - Input Offset Voltage: 5uV; Operating Temperature: -40℃~+125℃; Differential Voltage: ±80V; Single Supply: 2.7V~5.5V; Quiescent Current: 1.8mA; Input Offset Voltage Drift(Vos TC): 250nV/℃; Slew Rate: 2V/us; Common Mode Rejection Ratio (CMRR): 132dB; Noise density(eN): 40nV/√Hz@1kHz; Features: 模拟输出接口；双向检测；零漂移/自动稳零；可编程输出基准电平
R16 R19 = PTN0805E9002BST1: LCSC Part Name: 薄膜电阻 90kΩ ±0.1% 200mW; Supplier Part: C4122231; Manufacturer: VISHAY(威世); Supplier Footprint: 0805; JLCPCB Part Class: 扩展库; Datasheet: https://item.szlcsc.com/datasheet/PTN0805E9002BST1/4691526.html; Supplier: LCSC; Type: 薄膜电阻; Tolerance: ±0.1%; Power(Watts): 200mW; Temperature Coefficient: ±25ppm/℃; Operating Temperature: -55℃~+155℃
R17 R20 R28 = RT0603BRD0710KL: LCSC Part Name: 薄膜电阻 10kΩ ±0.1% 100mW; Supplier Part: C95204; Manufacturer: YAGEO(国巨); Supplier Footprint: 0603; JLCPCB Part Class: 扩展库; Datasheet: https://item.szlcsc.com/datasheet/RT0603BRD0710KL/96405.html; Supplier: LCSC; Type: 薄膜电阻; Tolerance: ±0.1%; Power(Watts): 100mW; Voltage-Supply(Max): 75V; Temperature Coefficient: ±25ppm/℃; Operating Temperature: -55℃~+155℃
U6 = GS8332-SR: LCSC Part Name: 具备射频滤波器的350KHz零漂移、轨到轨输入输出CMOS运算放大器; Supplier Part: C157713; Manufacturer: Gainsil(聚洵); Supplier Footprint: SOP-8; JLCPCB Part Class: 扩展库; Datasheet: https://item.szlcsc.com/datasheet/GS8332-SR/169061.html; Supplier: LCSC; Number of Channels: 双路; Single Supply: 1.8V~5.5V; Dual Supply: 900mV~2.75V；-2.75V~-900mV; Vos - Input Offset Voltage: 10uV; Input Offset Voltage Drift(Vos TC): 10nV/℃; Gain Bandwidth Product: 350kHz; Rail to Rail: 轨到轨输入,轨到轨输出; Slew Rate: 0.2V/us; Common Mode Rejection Ratio(CMRR): 110dB; Input Voltage Noise Density: 70nV/√Hz@1kHz; Ib - Input Bias Current: 20pA; Quiescent Current(Iq): 25uA; Output Current: 20mA; Input Offset Current(Ios): 10pA; Operating Temperature: -40℃~+125℃; Features: EMI滤波/RF抑制；零漂移/自动稳零
C33 C47 = 06035C104KAT2A: LCSC Part Name: 100nF ±10% 50V; Supplier Part: C88476; Manufacturer: Kyocera AVX; Supplier Footprint: 0603; JLCPCB Part Class: 扩展库; Datasheet: https://atta.szlcsc.com/upload/public/pdf/source/20170919/C88476_1505787417247977300.pdf; Supplier: LCSC; Tolerance: ±10%; Voltage Rated: 50V; Temperature Coefficient: X7R
C34 C40 C42 = TCC0603X5R106K100CT: LCSC Part Name: 10uF ±10% 10V; Supplier Part: C380314; Manufacturer: CCTC(三环); Supplier Footprint: 0603; Datasheet: https://item.szlcsc.com/datasheet/TCC0603X5R106K100CT/352719.html; Supplier: LCSC; Tolerance: ±10%; Voltage Rating: 10V; Temperature Coefficient: X5R
C36 C37 C44 C45 C49 C50 = CL31A106KBHNNNE: LCSC Part Name: 10uF ±10% 50V; Supplier Part: C13585; Manufacturer: SAMSUNG(三星); Supplier Footprint: 1206; JLCPCB Part Class: 基础库; Datasheet: https://item.szlcsc.com/datasheet/CL31A106KBHNNNE/14236.html; Supplier: LCSC; Tolerance: ±10%; Voltage Rating: 50V; Temperature Coefficient: X5R
C38 C46 = RVT1H470M0607_C72523: LCSC Part Name: 47uF ±20% 50V; Supplier Part: C72523; Manufacturer: ROQANG(容强); Manufacturer Part: RVT1H470M0607; Supplier Footprint: SMD,D6.3xL7.7mm; JLCPCB Part Class: 扩展库; Datasheet: https://item.szlcsc.com/datasheet/RVT1H470M0607/73634.html; Supplier: LCSC; Tolerance: ±20%; Voltage Rating: 50V; Ripple Current: 66mA@120Hz; Diameter: 6.3mm; Height - Seated (Max): 7.7mm; Lifetime: 2000hrs@105℃; Operating Temperature: -40℃~+105℃
C43 = CC0603KRX7R9BB103: LCSC Part Name: 10nF ±10% 50V; Supplier Part: C100042; Manufacturer: YAGEO(国巨); Supplier Footprint: 0603; JLCPCB Part Class: 扩展库; Datasheet: https://item.szlcsc.com/datasheet/CC0603KRX7R9BB103/101256.html; Supplier: LCSC; Tolerance: ±10%; Voltage Rating: 50V; Temperature Coefficient: X7R
D10 D11 D19 = SMF10A_C726899: LCSC Part Name: 单向TVS 10V截止 峰值浪涌电流：11.8A@10/1000us; Supplier Part: C726899; Manufacturer: TWGMC(迪嘉); Supplier Footprint: SOD-123FL; JLCPCB Part Class: 扩展库; Datasheet: https://item.szlcsc.com/datasheet/SMF10A/774004.html; Supplier: LCSC; Polarity: 单向; Reverse Stand-Off Voltage (Vrwm): 10V; Clamping Voltage: 17V; Peak Pulse Current (Ipp): 11.8A@10/1000us; Peak Pulse Power Dissipation (Ppp): 200W@10/1000us; Voltage - Breakdown: 12.3V; Reverse Leakage Current (Ir): 2.5uA; Number of Channels: 单路; Operating Temperature: -55℃~+150℃; Type: TVS
D22 = SMF5V0A_C42387343: LCSC Part Name: 单向TVS 5V截止 峰值浪涌电流：21.7A; Supplier Part: C42387343; Manufacturer: FUXINSEMI(富芯森美); Supplier Footprint: SOD-123; Datasheet: https://item.szlcsc.com/datasheet/SMF5V0A/44311387.html; Supplier: LCSC; Polarity: 单向; Reverse Stand-Off Voltage (Vrwm): 5V; Clamping Voltage: 9.2V; Peak Pulse Current (Ipp): 21.7A; Peak Pulse Power Dissipation (Ppp): 200W@10/1000us; Voltage - Breakdown: 7.25V; Reverse Leakage Current (Ir): 800uA; Number of Channels: 单路; Operating Temperature: -55℃~+150℃; level of protection: IEC 61000-4-2; Type: TVS
L1 = SRN4018-4R7M: LCSC Part Name: 4.7uH ±20% 2A; Supplier Part: C780206; Manufacturer: BOURNS; Supplier Footprint: SMD,4x4mm; JLCPCB Part Class: 扩展库; Datasheet: https://item.szlcsc.com/datasheet/SRN4018-4R7M/832173.html; Supplier: LCSC; Tolerance: ±20%; Current Rating: 1.9A; Current - Saturation(Isat): 2A; DC Resistance(DCR): 84mΩ
L2 = SWPA252012S4R7MT: LCSC Part Name: 4.7uH ±20% 1.25A; Supplier Part: C87640; Manufacturer: Sunlord(顺络); Supplier Footprint: 1008; JLCPCB Part Class: 扩展库; Datasheet: https://item.szlcsc.com/datasheet/SWPA252012S4R7MT/88818.html; Supplier: LCSC; Tolerance: ±20%; Current Rating: 840mA; Current - Saturation(Isat): 1.25A; DC Resistance(DCR): 377mΩ
R39 = 0603WAF1183T5E: LCSC Part Name: 厚膜电阻 118kΩ ±1%; Supplier Part: C25806; Manufacturer: UNI-ROYAL(厚声); Supplier Footprint: 0603; JLCPCB Part Class: 扩展库; Datasheet: https://item.szlcsc.com/datasheet/0603WAF1183T5E/26549.html; Supplier: LCSC; Type: 厚膜电阻; Tolerance: ±1%; Power(Watts): 100mW; Voltage-Supply(Max): 75V; Temperature Coefficient: ±100ppm/℃; Operating Temperature: -55℃~+155℃
R40 R42 = 0603WAF1002T5E: LCSC Part Name: 厚膜电阻 10kΩ ±1% 100mW; Supplier Part: C25804; Manufacturer: UNI-ROYAL(厚声); Supplier Footprint: 0603; JLCPCB Part Class: 基础库; Datasheet: https://item.szlcsc.com/datasheet/0603WAF1002T5E/26547.html; Supplier: LCSC; Type: 厚膜电阻; Tolerance: ±1%; Power(Watts): 100mW; Voltage-Supply(Max): 75V; Temperature Coefficient: ±100ppm/℃; Operating Temperature: -55℃~+155℃
R41 = RC0603FR-0753K6L: LCSC Part Name: 厚膜电阻 53.6kΩ ±1% 100mW; Supplier Part: C137700; Manufacturer: YAGEO(国巨); Supplier Footprint: 0603; JLCPCB Part Class: 扩展库; Datasheet: https://item.szlcsc.com/datasheet/RC0603FR-0753K6L/149016.html; Supplier: LCSC; Type: 厚膜电阻; Tolerance: ±1%; Power(Watts): 100mW; Voltage-Supply(Max): 75V; Temperature Coefficient: ±100ppm/℃; Operating Temperature: -55℃~+155℃
U9 U11 = RY8411_C2935411: LCSC Part Name: 降压型 1.2A 4V~38V; Supplier Part: C2935411; Manufacturer: RYCHiP(蕊源); Supplier Footprint: SOT-23-6; JLCPCB Part Class: 扩展库; Datasheet: https://item.szlcsc.com/datasheet/RY8411/3284876.html; Supplier: LCSC; Function: 降压型; Voltage - Supply: 4V~38V; Output Current: 1.2A; Frequency - Switching: 800kHz; Operating Temperature: -40℃~+85℃@(TA); Synchronous Rectifier: 是; Number of Outputs: 1; Topology: 降压式; Quiescent Current: 400uA; Switch tube (built-in/external): 内置; Output Type: 可调; Features: 轻载高效模式；逐波限流；过流保护
U10 = RS3236-3.3YF5: LCSC Part Name: 3.3V 500mA 7.5V; Supplier Part: C379349; Manufacturer: RUNIC(润石); Supplier Footprint: SOT-23-5; JLCPCB Part Class: 扩展库; Datasheet: https://item.szlcsc.com/datasheet/RS3236-3.3YF5/351761.html; Supplier: LCSC; Output Configuration: 正极; Voltage - Supply: 7.5V; Output Voltage: 3.3V; Output Current: 500mA; Power Supply Rejection Ratio (PSRR): 70dB@(1kHz); Voltage Dropout: 550mV@(300mA); standby current: 15uA; Noise: 80uVrms; Features: 使能控制；过流保护；噪声旁路端子；热关断; Operating Temperature: -40℃~+85℃@(Ta); Output Type: 固定; Number of Outputs: 1
C9 C18 C52-C55 = TCC1206X7R106K250HT: LCSC Part Name: 10uF ±10% 25V; Supplier Part: C380364; Manufacturer: CCTC(三环); Supplier Footprint: 1206; JLCPCB Part Class: 扩展库; Datasheet: https://item.szlcsc.com/datasheet/TCC1206X7R106K250HT/352769.html; Supplier: LCSC; Tolerance: ±10%; Voltage Rating: 25V; Temperature Coefficient: X7R
R18 R21 = RC0603FR-0768RL: LCSC Part Name: 厚膜电阻 68Ω ±1% 100mW; Supplier Part: C126362; Manufacturer: YAGEO(国巨); Supplier Footprint: 0603; JLCPCB Part Class: 扩展库; Datasheet: https://item.szlcsc.com/datasheet/RC0603FR-0768RL/137642.html; Supplier: LCSC; Type: 厚膜电阻; Tolerance: ±1%; Power(Watts): 100mW; Voltage-Supply(Max): 75V; Temperature Coefficient: ±100ppm/℃; Operating Temperature: -55℃~+155℃
U1 U3 = B1212S-1WR3: LCSC Part Name: DC-DC转换器; Supplier Part: C3031174; Manufacturer: YLPTEC(易川); Supplier Footprint: SIP,11.6x6mm; JLCPCB Part Class: 扩展库; Datasheet: https://item.szlcsc.com/datasheet/B1212S-1WR3/3567755.html; Supplier: LCSC; Number of Outputs: 1; Output Power: 1W; Voltage - Supply: 10.8V~13.2V; Conversion Efficiency: 90%; Output Voltage: 12V; Output Current(Max): 84mA; Capacitive Load(Max): 560uF; Isolation Voltage(Vrms): 1.5kV; Features: 短路保护；自动故障恢复；过热保护; Operating Temperature: -40℃~+105℃; Ripple Noise: 30mVp-p; Length: 11.6mm; Width: 6mm; Height: 10.16mm

## Nets
5V_FB: R41.1 R42.2 U11.3(FB)
12V_FB: R39.1 R40.2 U9.3(FB)
+3.3V: C10.2 C11.2 C12.2 C13.2 C14.2 C15.2 C16.2 C17.2 C19.2 C21.2 C22.2 C27.2 C40.2 C41.2 C42.2 C56.2 C57.2 C58.2 D4.1(C) F3.1 R13.2 R28.2 R30.2 R31.2 U2.5(VS) U2.6(REF2) U4.5(VS) U4.6(REF2) U5.5(VS) U5.6(REF2) U6.8(VDD) U7.1(VBAT) U7.13(VDDA/VREF+) U7.19(VDD) U7.32(VDD) U7.48(VDD) U7.64(VDD) U8.5(VIO) U10.5(OUT)
+5V: C26.2 C34.2 C39.2 C49.2 C50.2 C51.2 D22.1(C) FB2.1 L2.2 R41.2 U8.3(VCC) U10.1(IN) U10.3(EN)
+12V: C36.2 C37.2 C38.1 C54.2 C55.2 D19.2(K) J1.4 J4.3 L1.2 R39.2 U1.2(VIN) U3.2(VIN)
GND: C1.1 C3.1 C5.1 C8.1 C10.1 C11.1 C12.1 C13.1 C14.1 C15.1 C16.1 C17.1 C19.1 C20.1 C21.1 C22.1 C23.1 C24.1 C25.2 C26.1 C27.1 C28.2 C29.2 C30.2 C31.2 C32.2 C34.1 C36.1 C37.1 C38.2 C39.1 C40.1 C41.1 C42.1 C43.2 C44.1 C45.1 C46.2 C49.1 C50.1 C51.1 C54.1 C55.1 C56.1 C57.1 C58.1 D4.2(A) D5.2 D19.1(A) D22.2(A) J1.3 J2.3 J2.4 J3.3 J3.5 J3.6 J5.2 J5.4 J6.1 J6.3 Q1.2(S) R6.1 R7.2 R8.2 R10.2 R11.2 R14.2 R17.1 R20.1 R40.1 R42.1 U1.1(GND) U2.1(NC) U2.4(GND) U2.7(REF1) U3.1(GND) U4.1(NC) U4.4(GND) U4.7(REF1) U5.1(NC) U5.4(GND) U5.7(REF1) U6.4(VSS) U7.12(VSSA/VREF-) U7.18(VSS) U7.31(VSS) U7.47(VSS) U7.63(VSS) U8.2(GND) U8.8(STB) U9.2(GND) U10.2(GND) U11.2(GND) Y1.2(VSS)
A_H: D6.2(+) R1.1 U7.41(PA8)
A_H_OUT: J6.4 R1.2
A_HB: C18.2 D10.1(A) J4.1 R18.2
A_I: R23.1 U4.8(OUT)
A_I_ADC: C28.1 R23.2 U7.16(PA2)
A_L: D7.2(+) R2.1 U7.42(PA9)
A_L_OUT: J6.2 R2.2
A_POWER: D1.2 R12.2 R16.1 U4.3(IN-)
A_SW: C9.1 C18.1 D10.2(K) J4.2 U1.3(-VO)
B_H: D8.2(+) R3.1 U7.43(PA10)
B_H_OUT: J5.1 R3.2
B_HB: C53.2 D11.2(K) J1.2 R21.2
B_L: D9.2(+) R4.1 U7.44(PA11)
B_L_OUT: J5.3 R4.2
B_POWER: D2.2 R15.1 R19.2 U5.3(IN-)
B_SW: C52.1 C53.1 D11.1(A) J1.1 U3.3(-VO)
BUZZER: R5.1 R6.2 U7.26(PB0)
CAN_RX: U7.61(PB8) U8.4(RXD)
CAN_TX: U7.62(PB9) U8.1(TXD)
CANH: J2.2 R25.2 U8.7(CANH)
CANL: J2.1 R25.1 U8.6(CANL)
CAP+: F2.2
CAP_I: R24.1 U5.8(OUT)
CAP_I_ADC: C29.1 R24.2 U7.9(PC1)
CHASSIS+: F1.1 R9.1 TP2.1 U2.3(IN-)
IA+: F1.2 R12.1 U4.2(IN+)
IB+: F2.1 R15.2 U5.2(IN+)
NRST: C20.2 R13.1 U7.7(NRST)
NTC: J4.4 R37.1
PB14: D14.1(-) U7.35(PB14)
PB15: D13.1(-) U7.36(PB15)
PC6: U7.37(PC6)
PC7: U7.38(PC7)
PC8: U7.39(PC8)
PC9: U7.40(PC9)
REFEREE+: R9.2 TP3.1 U2.2(IN+)
REFEREE_I: R22.1 U2.8(OUT)
REFEREE_I_ADC: C25.1 R22.2 U7.15(PA1)
SWDCK: R36.1 U7.49(PA14)
SWDIO: R38.1 U7.46(PA13)
THERMISTOR_ADC: C32.1 R28.1 R37.2 U7.10(PC2)
VASENSE: R26.1 U6.1(OUTA) U6.2(INA-)
VASENSE_ADC: C30.1 R26.2 U7.14(PA0)
VBSENSE: R27.1 U6.6(INB-) U6.7(OUTB)
VBSENSE_ADC: C31.1 R27.2 U7.11(PC3)
VPP: C1.2 C8.2 C44.2 C45.2 C46.1 D5.1 FB1.2 TP1.1 U9.4(EN) U9.5(IN) U11.4(EN) U11.5(IN)
$2N395: C33.1 U9.1(BS)
$2N400: C33.2 L1.1 U9.6(SW)
$2N898: C47.2 L2.1 U11.6(SW)
$2N906: C47.1 U11.1(BS)
$2N2458: C43.1 U10.4(BP)
$3N995: C52.2 R21.1 U3.4(+VO)
$3N1072: C9.2 R18.1 U1.4(+VO)
$4N2424: D1.1 D2.1 F4.1
$4N2466: F4.2 FB1.1
$5N816: C23.2 R16.2 R17.2 U6.3(INA+)
$5N931: C24.2 R19.1 R20.2 U6.5(INB+)
$6N1658: R14.1 U7.60(BOOT0)
$6N2201: F3.2 J3.4
$6N2296: J3.2 R36.2
$6N2335: J3.1 R38.2
$6N2874: BZ1.1 C3.2 C4.2 C5.2 D3.1 FB2.2
$6N3165: BZ1.2 C4.1 D3.2 Q1.3(D)
$6N3346: Q1.1(G) R5.2
$6N4575: D6.1(-) R7.1
$6N4614: D7.1(-) R8.1
$6N4653: D8.1(-) R10.1
$6N4961: D13.2(+) R30.1
$6N5000: D14.2(+) R31.1
$6N5245: U7.5(PF0/OSCIN) Y1.1
$6N5251: U7.6(PF1/OSCOUT) Y1.3
$6N5292: D9.1(-) R11.1

Not connected (* = marked no-connect by the designer): U7 2(PC13)* 3(PC14/OSC32_IN)* 4(PC15/OSC32_OUT)* 8(PC0)* 17(PA3)* 20(PA4)* 21(PA5)* 22(PA6)* 23(PA7)* 24(PC4)* 25(PC5)* 27(PB1)* 28(PB2)* 29(PB10)* 30(PB11)* 33(PB12)* 34(PB13)* 45(PA12)* 50(PA15)* 51(PC10)* 52(PC11)* 53(PC12)* 54(PD2)* 55(PB3)* 56(PB4)* 57(PB5)* 58(PB6)* 59(PB7)*

## Notes on the sheets
sheet 3
- referee_i总
- DCDC_A侧
- DCDC_B测
sheet 4
- 电阻25ppm
